# EasyEDA Pro project ProPrj_arduinouno_2024-09-28.epro

# Schematic Schematic1
Board Name: Board1; Create Date: 2024-09-04
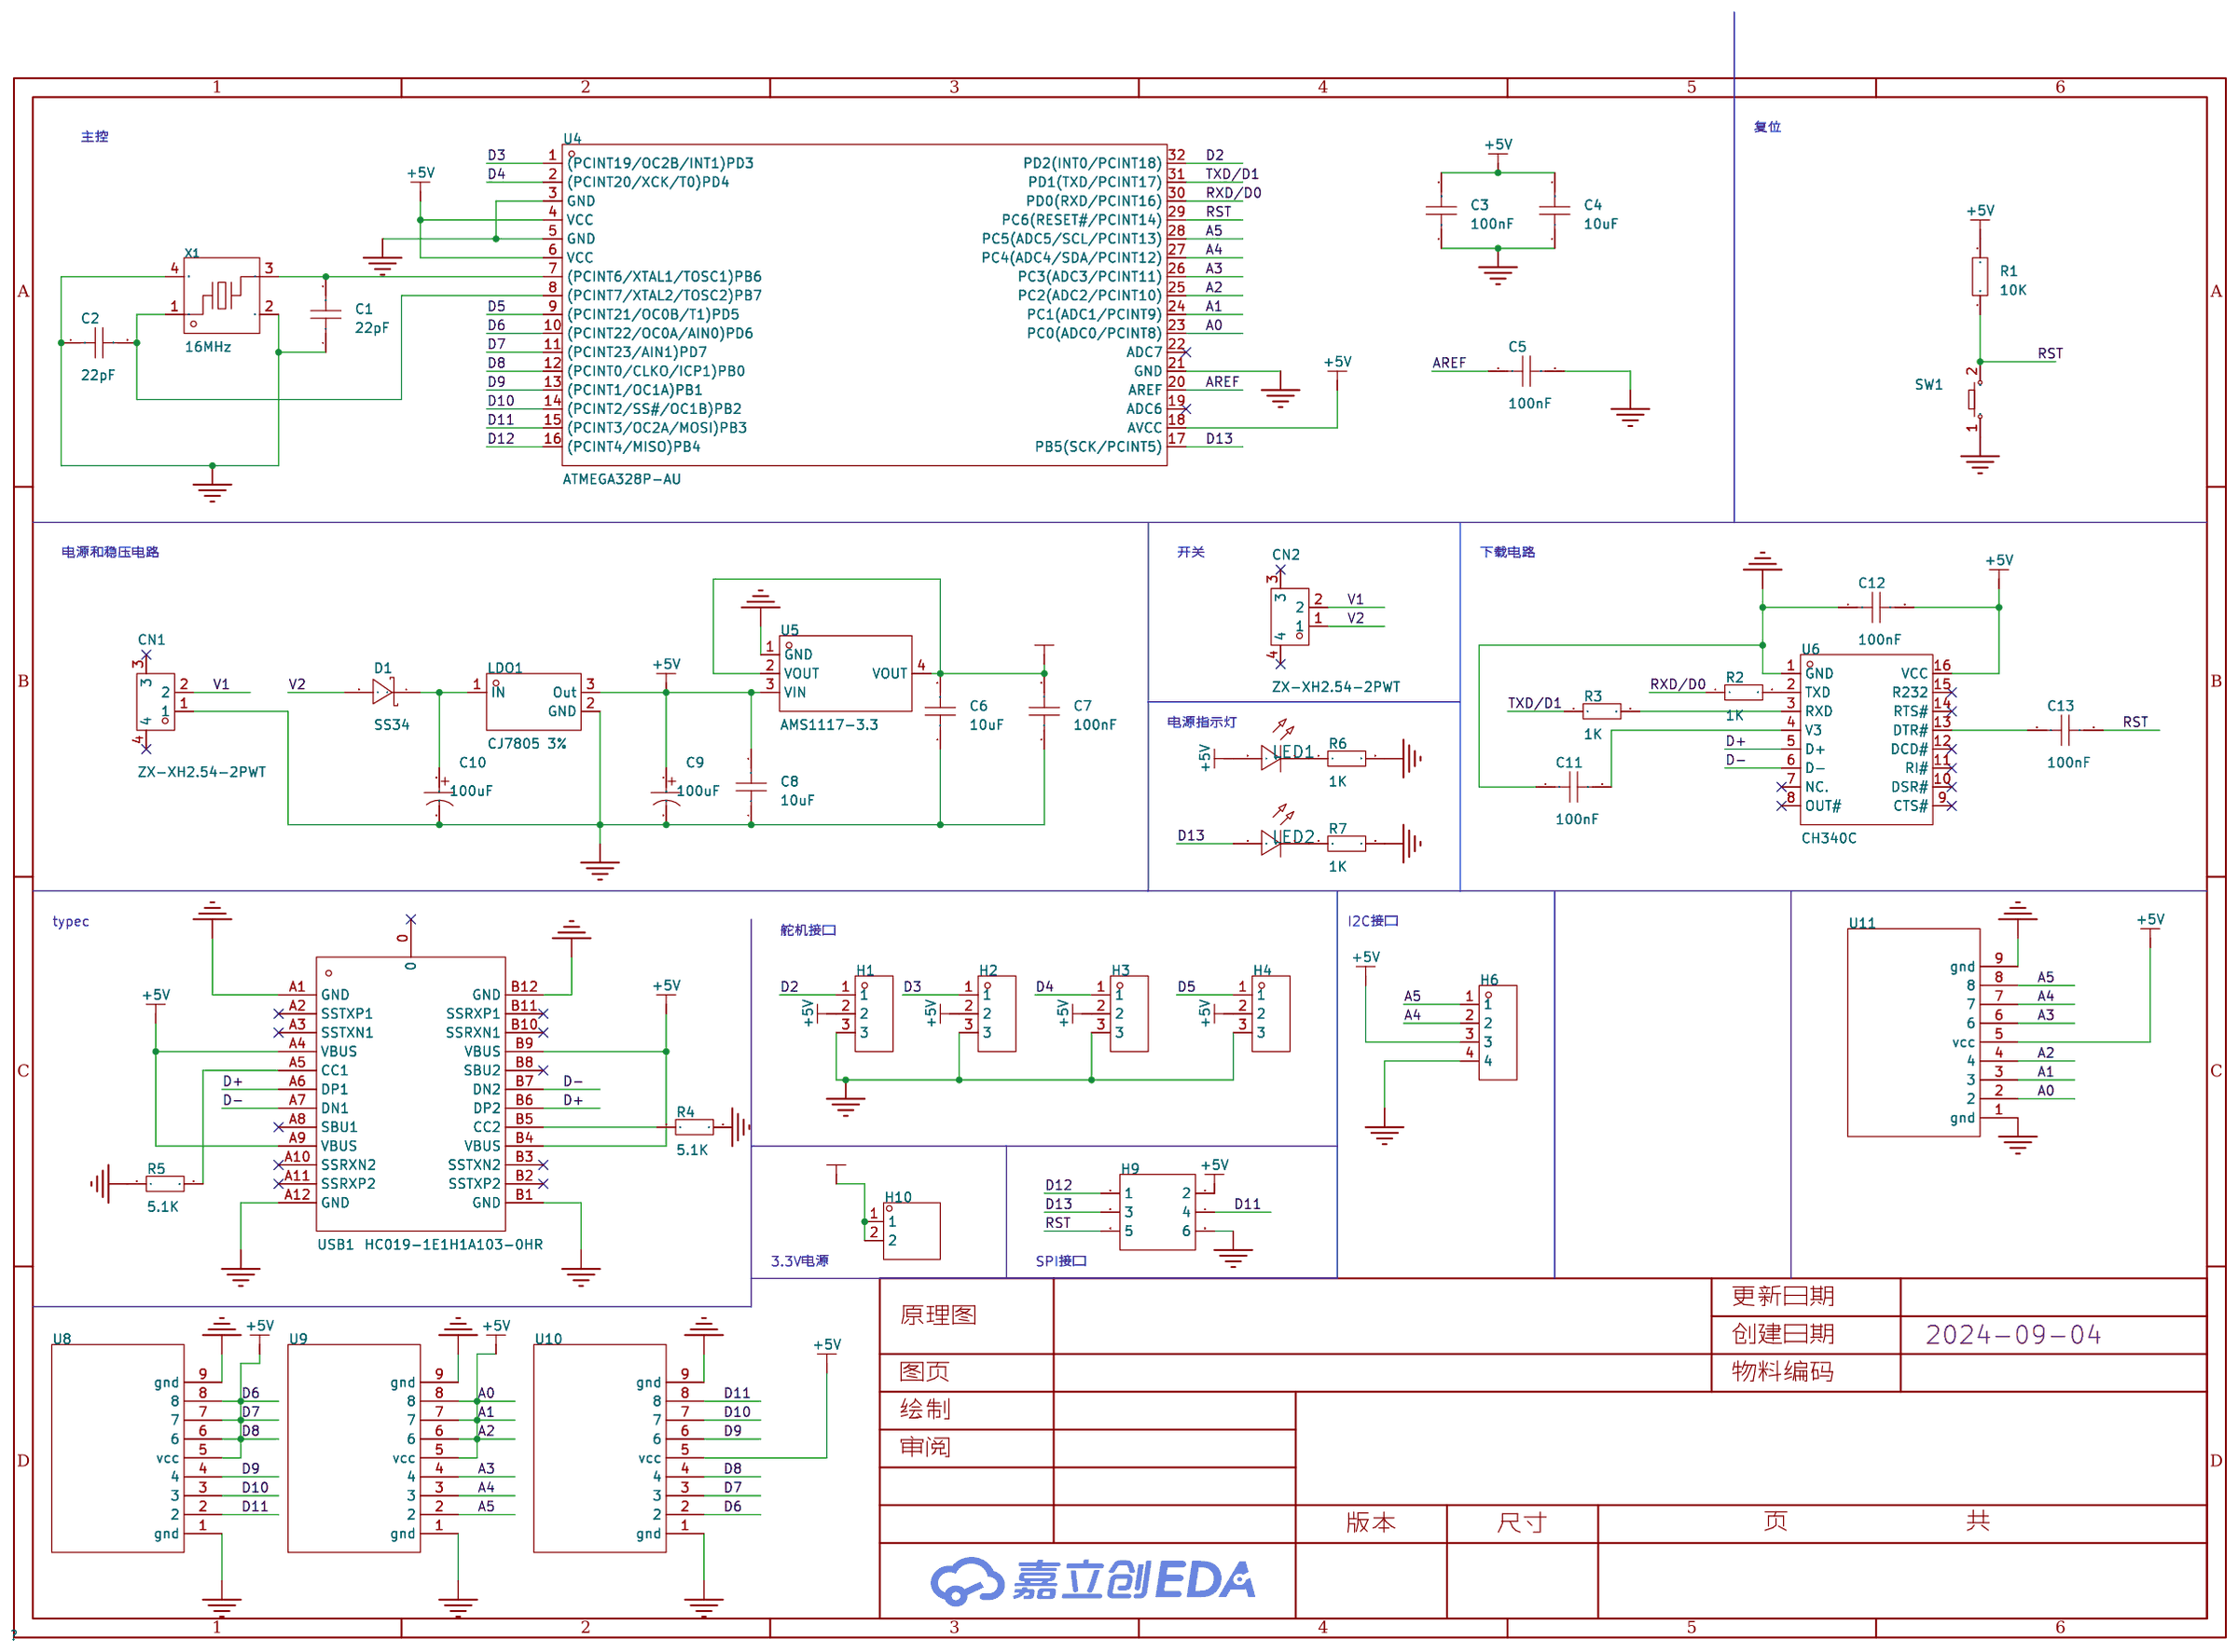
[diagram p0: schematic sheet]

## Parts
C1  22pF  [C0603]
C2  22pF  [C0603]
C3  100nF  [C0603]
C4  10uF  [C0603]
C5  100nF  [C0603]
C6  10uF  [C0603]
C7  100nF  [C0603]
C8  10uF  [C0603]
C9  100uF  [CAP-SMD_BD6.3-L6.6-W6.6-LS7.2-R-RD]
C10  100uF  [CAP-SMD_BD6.3-L6.6-W6.6-LS7.2-R-RD]
C11  100nF  [C0603]
C12  100nF  [C0603]
C13  100nF  [C0603]
CN1  ZX-XH2.54-2PWT  [CONN-SMD_2P-P2.54_MEGASTAR_ZX-XH2.54-2PWT]
CN2  ZX-XH2.54-2PWT  [CONN-SMD_2P-P2.54_MEGASTAR_ZX-XH2.54-2PWT]
D1  SS34  [SMA_L4.4-W2.8-LS5.4-RD]
H1  -  [HDR-TH_3P-P2.54-V-M]
H2  -  [HDR-TH_3P-P2.54-V-M]
H3  -  [HDR-TH_3P-P2.54-V-M]
H4  -  [HDR-TH_3P-P2.54-V-M]
H6  -  [HDR-TH_4P-P2.54-V-M]
H9  -  [HDR-TH_6P-P2.54-V-R2-C3-S2.54_A2541WV-2X3P]
H10  -  [HDR-TH_2P-P2.54-V-M-1]
LDO1  CJ7805 3%  [TO-252-2_L6.6-W6.1-P4.58-LS10.1-BR-CW]
LED1  -  [LED_0603]
LED2  -  [LED_0603]
R1  10K  [R0603]
R2  1K  [R0603]
R3  1K  [R0603]
R4  5.1K  [R0603]
R5  5.1K  [R0603]
R6  1K  [R0603]
R7  1K  [R0603]
SW1  -  [Key_SMD_3x4x2]
U4  ATMEGA328P-AU  [TQFP-32_L7.0-W7.0-P0.80-LS9.0-BL]
U5  AMS1117-3.3  [SOT-223-3_L6.5-W3.4-P2.30-LS7.0-BR]
U6  CH340C  [SOP-16_L10.0-W3.9-P1.27-LS6.0-BL]
U8  -  [金手指（20p)]
U9  -  [金手指（20p)]
U10  -  [金手指（20p)]
U11  -  [金手指（20p)]
USB1  HC019-1E1H1A103-0HR  [USB-C-SMD_HC019-1E1H1A103-0HR]
X1  16MHz  [CRYSTAL-SMD_4P-L3.2-W2.5-BL-2]

## Library data of the parts
C1-C8 C11-C13 = CAP_0603: Supplier Footprint: 0603
C9 C10 = RVE1V101M0607_C99837: 容值:100uF;精度:±20%;额定电压:35V;纹波电流:230mA@120Hz;等效串联电阻:600mΩ;; LCSC Part Name: 100uF ±20% 35V; Supplier Part: C99837; Manufacturer: ROQANG(容强); Manufacturer Part: RVE1V101M0607; Supplier Footprint: SMD,D6.3xL7.7mm; Datasheet: https://atta.szlcsc.com/upload/public/pdf/source/20170408/1491621582616.pdf; Supplier: LCSC; Tolerance: ±20%; Rated Voltage: 35V; Ripple Current: 230mA@120Hz; Equivalent Series Resistance(ESR): 600mΩ; φD: 6.3mm; L: 7.7mm; Lifetime @ Temp: 2000hrs@105℃; Operating Temperature: -55℃~+105℃
CN1 CN2 = ZX-XH2.54-2PWT: 插针结构:1x2P;间距:2.54mm;安装方式:卧贴;参考系列:XH;总PIN数:2P;排数:1;每排PIN数:2;行距:-;额定电流:3A;触头材质:黄铜;触头镀层:锡;工作温度范围:-25℃~+85℃;; Supplier Part: C7429671; Manufacturer: Megastar(兆星); Supplier Footprint: SMD,P=2.54mm,卧贴; JLCPCB Part Class: 扩展库; Datasheet: https://atta.szlcsc.com/upload/public/pdf/source/20230619/D2020A0565D707024C90AEAD14B7AF42.pdf; Supplier: LCSC; Pins Structure: 1x2P; Pitch: 2.54mm; Mounting Style: 卧贴; Reference Series: XH; Number of Pins: 2P; Number of Rows: 1; Number of PINs Per Row: 2; Current Rating (Max): 3A; Contact Material: 黄铜; Contact Plating: 锡; Operating Temperature Range: -25℃~+85℃
D1 = SS34_C266553: 正向压降(Vf):500mV@3A;直流反向耐压(Vr):40V;整流电流:3A;; LCSC Part Name: 电压:40V 电流:3A; Supplier Part: C266553; Manufacturer: BORN(伯恩半导体); Supplier Footprint: SMA(DO-214AC); JLCPCB Part Class: 扩展库; Datasheet: https://atta.szlcsc.com/upload/public/pdf/source/20180817/C266554_F1CD22E2170B80947B6B70E19B5A0CE6.pdf; Supplier: LCSC; Forward Voltage (Vf@If): 500mV@3A; Reverse Voltage (Vr): 40V; Rectified Current: 3A
H1-H4 = HDR-M_2.54_1x3P: Supplier Part: C2937625; Supplier Footprint: 插件
H6 = HDR-M_2.54_1x4P: Supplier Part: C492403; Supplier Footprint: 插件
H9 = HDR-M_2.54_2x3: Supplier Part: C402781; Supplier Footprint: 插件,P=2.54mm
H10 = HDR-M_2.54_1x2P: Supplier Part: C124375; Supplier Footprint: 插件
LDO1 = CJ7805 3%: 输出类型:固定;最大输入电压:35V;输出电压:5V;最大输出电流:1.5A;输出极性:正极;; LCSC Part Name: 输入35V 输出5V 1.5A; Supplier Part: C21706; Manufacturer: CJ(江苏长电/长晶); Supplier Footprint: TO-252-2(DPAK); JLCPCB Part Class: 扩展库; Datasheet: https://atta.szlcsc.com/upload/public/pdf/source/20171228/C164904_15144413121361213907.pdf; Supplier: LCSC; Output Type: 固定; Maximum Input Voltage: 35V; Output Voltage: 5V; MAX Output Current: 1.5A; Dropout Voltage: 2V@(1A); Output Polarity: 正极; Number of Outputs: 1
LED1 LED2 = LED_0603-R: Supplier Footprint: 0603
R1-R7 = Res_0603: Supplier Footprint: 0603
SW1 = Key_SMD_3x4x2: Supplier Footprint: SMD
U4 = ATMEGA328P-AU: CPU内核:AVR;程序存储容量:32KB;RAM总容量:2KB;GPIO端口数量:23;工作电压范围:1.8V~5.5V;CPU最大主频:20MHz;程序存储器类型:FLASH;应用领域:-;; LCSC Part Name: 基于AVR增强型RISC架构的低功耗CMOS 8位微控制器; Supplier Part: C14877; Manufacturer: MICROCHIP(美国微芯); Supplier Footprint: TQFP-32(7x7); Datasheet: https://atta.szlcsc.com/upload/public/pdf/source/20140621/1457707095197.pdf; Supplier: LCSC; CPU Core: AVR; Program Storage Size: 32KB; RAM Size: 2KB; GPIO Ports Number: 23; Operating Voltage Range: 1.8V~5.5V; CPU Maximum Speed: 20MHz; Program Memory Type: FLASH; EEPROM: 1KB; Operating Temperature Range: -40℃~+85℃; ADC (Bit): 10bit; Peripheral/Function: 看门狗；PWM；看门狗；PWM; Watchdog: 有; Low-Voltage Detect: 有; Internal Oscillator: 有
U5 = AMS1117-3.3_C6186: 输出类型:固定;最大输入电压:-;输出电压:3.3V;最大输出电流:1A;电源纹波抑制比(PSRR):72dB@(120Hz);输出极性:正极;; LCSC Part Name: 输出3.3V 1A; Supplier Part: C6186; Manufacturer: AMS; Supplier Footprint: SOT-223; Datasheet: https://atta.szlcsc.com/upload/public/pdf/source/20180727/C6186_7A095716F0823C02F1997A905E26C086.pdf; Supplier: LCSC; Output Type: 固定; Output Voltage: 3.3V; MAX Output Current: 1A; Power Supply Rejection Ratio (PSRR): 72dB@(120Hz); Dropout Voltage: 1.3V@(800mA); Output Polarity: 正极; Number of Outputs: 1
U6 = CH340C: 应用功能:收发器;接口协议:USB 2.0;数据速率:2Mbps;; LCSC Part Name: CH340C USB转串口芯片 CH340; Supplier Part: C84681; Manufacturer: WCH(南京沁恒); Supplier Footprint: SOP-16; JLCPCB Part Class: 扩展库; Datasheet: https://atta.szlcsc.com/upload/public/pdf/source/20200819/C84681_ADBED554CE321879DBD6B1D06488689C.pdf; Supplier: LCSC; Applications Function: 收发器; Protocol: USB 2.0; Supply Voltage: 3.3V；5V; Data Rate: 2Mbps
U8-U11 = 2.54金手指（20p)
USB1 = HC019-1E1H1A103-0HR: 连接器类型:Type-C;标准:-;公母:母;端口数量:1;触点数量:24P;安装方式:立贴;额定电流 - 电源:5A;触头材质:高导铜;触头镀层:金;工作温度范围:-25℃~+85℃;焊接温度(最大值):260℃;; LCSC Part Name: Type-C 母 立贴; Supplier Part: C2894918; Manufacturer: HCTL(华灿天禄); Supplier Footprint: SMD; JLCPCB Part Class: 扩展库; Datasheet: https://atta.szlcsc.com/upload/public/pdf/source/20221116/A833A3B5655DC5CBECD3BDA709D92211.pdf; Supplier: LCSC; Connector Type: Type-C; Gender: 母; Number of Ports: 1; Number of Contacts: 24P; Mounting Style: 立贴; Current Rating - Power (Max): 5A; Contact Material: 高导铜; Contact Plating: 金; Operating Temperature Range: -25℃~+85℃; Soldering Temperature(Max): 260℃
X1 = NX3225SA-16MHz-STD-CSR-6: 频率:16MHz;常温频差:±15ppm;外接负载电容:8pF;频率稳定度(全温):±25ppm;; LCSC Part Name: 16MHz ±15ppm 8pF; Supplier Part: C880097; Manufacturer: NDK; Supplier Footprint: SMD3225-4P; JLCPCB Part Class: 扩展库; Supplier: LCSC; Normal temperature Frequency Tolerance: ±15ppm; External load capacitor: 8pF; Frequency Stability(Full temperature range): ±25ppm; Equivalent Series Resistance (ESR): 80Ω; Operating Temperature: -40℃~+85℃

## Nets
3V3: C6.2 C7.2 H10.1 H10.2 U5.2(VOUT) U5.4(VOUT)
+5V: C3.2 C4.2 C8.2 C9.1 C12.2 H1.2 H2.2 H3.2 H4.2 H6.3 H9.2 LDO1.3(Out) LED1.2(A) R1.2 U4.4(VCC) U4.6(VCC) U4.18(AVCC) U5.3(VIN) U6.16(VCC) U8.5(vcc) U9.5(vcc) U10.5(vcc) U11.5(vcc) USB1.A4(VBUS) USB1.A9(VBUS) USB1.B4(VBUS) USB1.B9(VBUS)
GND: C1.1 C2.1 C3.1 C4.1 C5.2 C6.1 C7.1 C8.1 C9.2 C10.2 C11.1 C12.1 CN1.1 H1.3 H2.3 H3.3 H4.3 H6.4 H9.6 LDO1.2(GND) R4.2 R5.1 R6.2 R7.2 SW1.1 U4.3(GND) U4.5(GND) U4.21(GND) U5.1(GND) U6.1(GND) U8.1(gnd) U8.9(gnd) U9.1(gnd) U9.9(gnd) U10.1(gnd) U10.9(gnd) U11.1(gnd) U11.9(gnd) USB1.A1(GND) USB1.A12(GND) USB1.B1(GND) USB1.B12(GND) X1.2(GND) X1.4(GND)
V1: CN1.2 CN2.2
V2: CN2.1 D1.2(A)
A0: U4.23(PC0(ADC0/PCINT8)) U9.8 U11.2
A1: U4.24(PC1(ADC1/PCINT9)) U9.7 U11.3
A2: U4.25(PC2(ADC2/PCINT10)) U9.6 U11.4
A3: U4.26(PC3(ADC3/PCINT11)) U9.4 U11.6
A4: H6.2 U4.27(PC4(ADC4/SDA/PCINT12)) U9.3 U11.7
A5: H6.1 U4.28(PC5(ADC5/SCL/PCINT13)) U9.2 U11.8
AREF: C5.1 U4.20(AREF)
D2: H1.1 U4.32(PD2(INT0/PCINT18))
D3: H2.1 U4.1((PCINT19/OC2B/INT1)PD3)
D4: H3.1 U4.2((PCINT20/XCK/T0)PD4)
D5: H4.1 U4.9((PCINT21/OC0B/T1)PD5)
D6: U4.10((PCINT22/OC0A/AIN0)PD6) U8.8 U10.2
D7: U4.11((PCINT23/AIN1)PD7) U8.7 U10.3
D8: U4.12((PCINT0/CLKO/ICP1)PB0) U8.6 U10.4
D9: U4.13((PCINT1/OC1A)PB1) U8.4 U10.6
D10: U4.14((PCINT2/SS#/OC1B)PB2) U8.3 U10.7
D11: H9.4 U4.15((PCINT3/OC2A/MOSI)PB3) U8.2 U10.8
D12: H9.1 U4.16((PCINT4/MISO)PB4)
D13: H9.3 LED2.2(A) U4.17(PB5(SCK/PCINT5))
D+: U6.5(D+) USB1.A6(DP1) USB1.B6(DP2)
D-: U6.6(D-) USB1.A7(DN1) USB1.B7(DN2)
RST: C13.2 H9.5 R1.1 SW1.2 U4.29(PC6(RESET#/PCINT14))
RXD/D0: R2.1 U4.30(PD0(RXD/PCINT16))
TXD/D1: R3.1 U4.31(PD1(TXD/PCINT17))
$1N1524: C1.2 U4.7((PCINT6/XTAL1/TOSC1)PB6) X1.3
$1N1530: C2.2 U4.8((PCINT7/XTAL2/TOSC2)PB7) X1.1
$1N2494: C10.1 D1.1(C) LDO1.1(IN)
$1N3868: R2.2 U6.2(TXD)
$1N3894: R3.2 U6.3(RXD)
$1N4022: C11.2 U6.4(V3)
$1N11196: LED1.1(C) R6.1
$1N13420: R4.1 USB1.B5(CC2)
$1N13426: R5.2 USB1.A5(CC1)
$1N15243: C13.1 U6.13(DTR#)
Net-(LED2-1): LED2.1(C) R7.1

Not connected (* = marked no-connect by the designer): CN1 3* 4*; CN2 3* 4*; U4 19(ADC6)* 22(ADC7)*; U6 7(NC.)* 8(OUT#)* 9(CTS#)* 10(DSR#)* 11(RI#)* 12(DCD#)* 14(RTS#)* 15(R232)*; USB1 0* A2(SSTXP1)* A3(SSTXN1)* A8(SBU1)* A10(SSRXN2)* A11(SSRXP2)* B2(SSTXP2)* B3(SSTXN2)* B8(SBU2)* B10(SSRXN1)* B11(SSRXP1)*

## Notes on the sheet
- 主控
- 复位
- 电源和稳压电路
- 开关
- 下载电路
- 电源指示灯
- typec
- 舵机接口
- I2C接口
- 3.3V电源
- SPI接口

# Board PCB1
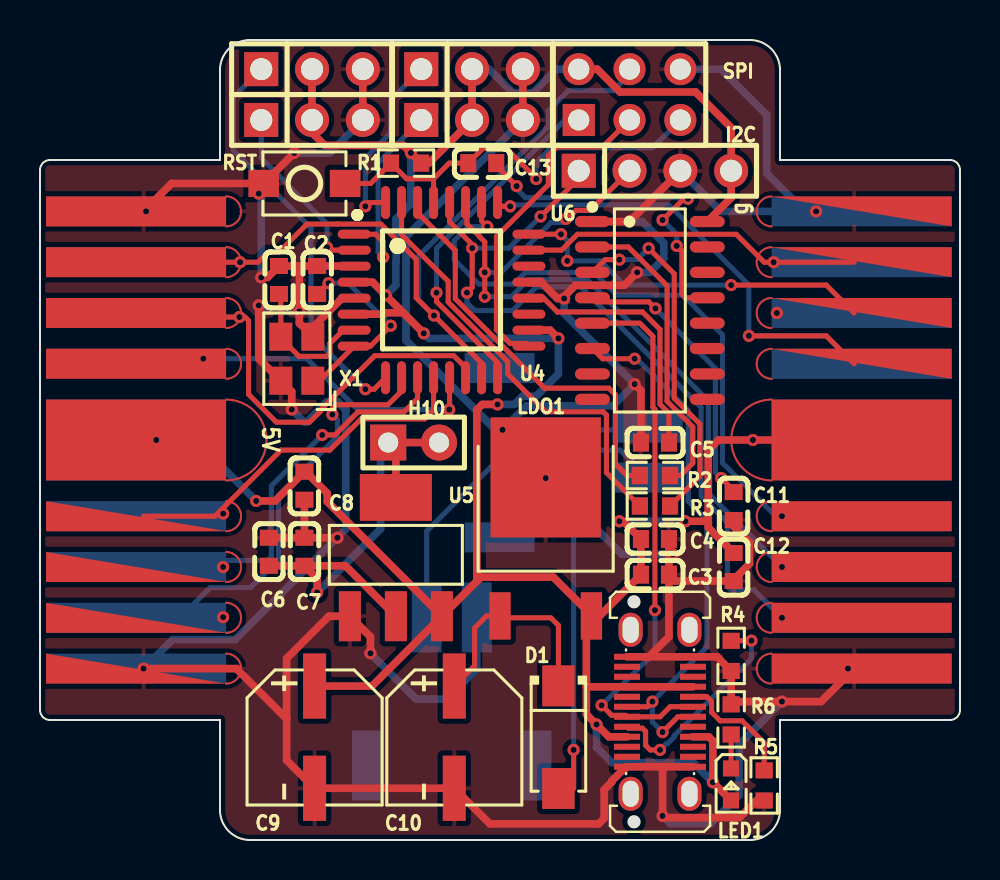
[diagram p1: board, top side]
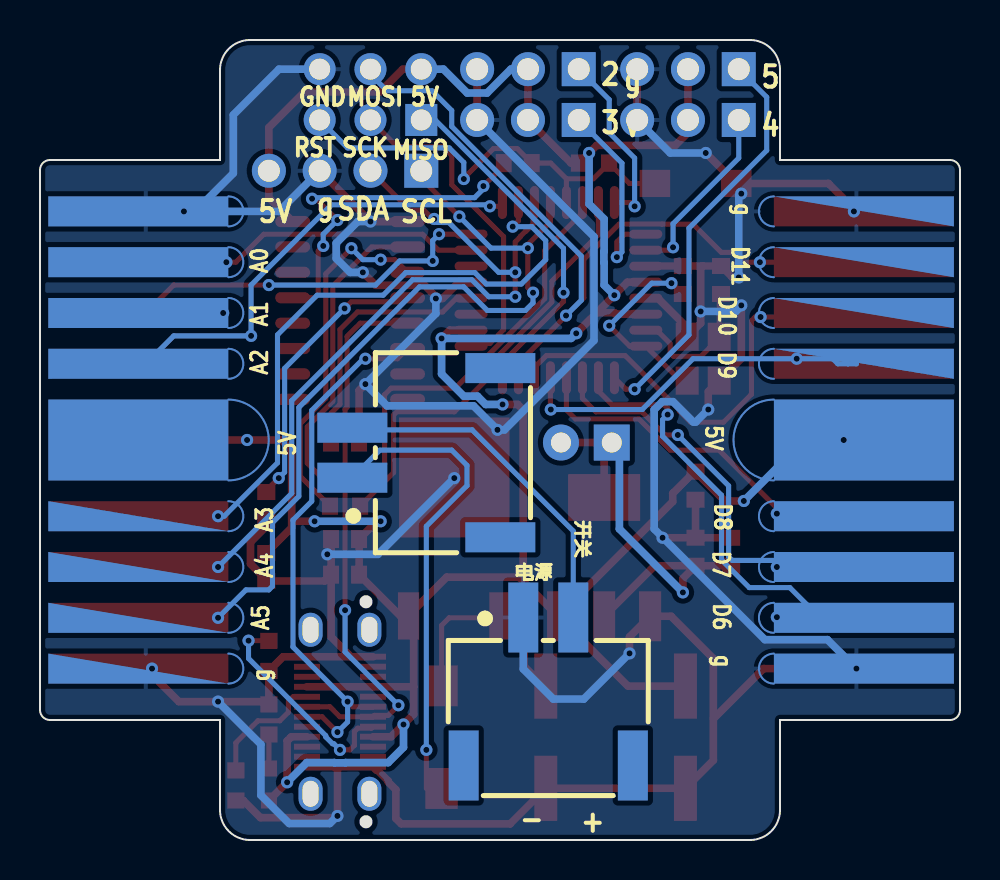
[diagram p2: board, bottom side, seen from below]

Outline 46 x 40 mm; copper layers: Top Layer, Bottom Layer. Coordinates in mm from the lower left corner of the outline.
Outline path: 0,33.5 arc(0.15,33.85) 0.5,34 9,34 9,38.5 arc(9.44,39.56) 10.5,40 35.5,40 arc(36.56,39.56) 37,38.5 37,34 45.5,34 arc(45.85,33.85) 46,33.5 46,6.5 arc(45.85,6.15) 45.5,6 37,6 37,1.5 arc(36.56,0.44) 35.5,0 10.5,0 arc(9.44,0.44) 9,1.5 9,6 0.5,6 arc(0.15,6.15) 0,6.5 0,33.5
Stack: Top Layer 0.035mm / Dielectric1 1.51mm FR4 er 4.5 / Bottom Layer 0.035mm

## Design rules (mm)
template: 自定义配置
spacing copperThickness1oz (default): track to track 0.102, other pairs 0.152 to 0.3
spacing copperThickness2oz: track to track 0.203, other pairs 0.152 to 0.3
track width copperThickness1oz (default): min 0.127, default 0.254, max 2.54
track width copperThickness2oz: min 0.203, default 0.254, max 2.54
track width 电源: min 0.127, default 0.381, max 2.54
differential pair differentialPair (default): width min 0.127, default 0.254, max 2.54; gap min 0.152, default 0.152
via viaSize (default): diameter min 0.5, default 0.61, max 10; hole min 0.3, default 0.305, max 6.299
net GND uses 电源
net +5V uses 电源
net 3V3 uses 电源

## Placement (name value [footprint] x y rotation side)
C1  22pF  [C0603]  11.95 28 270 top
C2  22pF  [C0603]  13.86 28 270 top
C3  100nF  [C0603]  30.75 15.05 180 top
C4  10uF  [C0603]  30.75 13.27 180 top
C5  100nF  [C0603]  30.75 19.87 180 top
C6  10uF  [C0603]  11.44 14.41 270 top
C7  100nF  [C0603]  13.22 14.41 270 top
C8  10uF  [C0603]  13.22 17.71 90 top
C9  100uF  [CAP-SMD_BD6.3-L6.6-W6.6-LS7.2-R-RD]  13.73 5.14 90 top
C10  100uF  [CAP-SMD_BD6.3-L6.6-W6.6-LS7.2-R-RD]  20.71 5.14 90 top
C11  100nF  [C0603]  34.68 16.7 90 top
C12  100nF  [C0603]  34.68 13.65 90 top
C13  100nF  [C0603]  22.11 33.84 180 top
D1  SS34  [SMA_L4.4-W2.8-LS5.4-RD]  25.92 5.14 270 top
H1  -  [HDR-TH_3P-P2.54-V-M]  21.6 38.54 0 top
H2  -  [HDR-TH_3P-P2.54-V-M]  21.6 36 0 top
H3  -  [HDR-TH_3P-P2.54-V-M]  13.6 36 0 top
H4  -  [HDR-TH_3P-P2.54-V-M]  13.6 38.54 0 top
H10  -  [HDR-TH_2P-P2.54-V-M-1]  18.68 19.87 0 top
I2C  -  [HDR-TH_4P-P2.54-V-M]  30.75 33.46 0 top
LDO1  CJ7805 3%  [TO-252-2_L6.6-W6.1-P4.58-LS10.1-BR-CW]  25.29 14.67 270 top
LED1  -  [LED_0603]  34.56 2.73 270 top
R1  10K  [R0603]  18.3 33.84 0 top
R2  1K  [R0603]  30.75 18.22 0 top
R3  1K  [R0603]  30.75 16.7 0 top
R4  5.1K  [R0603]  34.56 9.2 270 top
R5  5.1K  [R0603]  36.21 2.73 90 top
R6  1K  [R0603]  34.56 6.03 90 top
RST  -  [Key_SMD_3x4x2]  13.22 32.83 0 top
SPI  -  [HDR-TH_6P-P2.54-V-R2-C3-S2.54_A2541WV-2X3P]  29.48 37.27 0 top
U4  ATMEGA328P-AU  [TQFP-32_L7.0-W7.0-P0.80-LS9.0-BL]  20.08 27.49 270 top
U5  AMS1117-3.3  [SOT-223-3_L6.5-W3.4-P2.30-LS7.0-BR]  17.79 14.16 270 top
U6  CH340C  [SOP-16_L10.0-W3.9-P1.27-LS6.0-BL]  30.49 26.48 270 top
U8  -  [金手指（20p)]  0.3 20 270 top
U9  -  [金手指（20p)]  45.58 20 90 top
U10  -  [金手指（20p)]  0.3 20 90 bottom
U11  -  [金手指（20p)]  45.58 20 270 bottom
USB1  HC019-1E1H1A103-0HR  [USB-C-SMD_HC019-1E1H1A103-0HR]  31 6.41 90 top
X1  16MHz  [CRYSTAL-SMD_4P-L3.2-W2.5-BL-2]  12.84 24.06 90 top
开关  ZX-XH2.54-2PWT  [CONN-SMD_2P-P2.54_MEGASTAR_ZX-XH2.54-2PWT]  26.68 19.36 90 bottom
电源  ZX-XH2.54-2PWT  [CONN-SMD_2P-P2.54_MEGASTAR_ZX-XH2.54-2PWT]  20.59 7.43 180 bottom

## Footprints (pads in the part's own frame, mm; a bottom-side part is the same pattern mirrored in y, then rotated)
C0603
  rect 0.8x0.9 smd: 1(-0.7,0) 2(0.7,0)
CAP-SMD_BD6.3-L6.6-W6.6-LS7.2-R-RD
  rect 3.26x1.15 smd: 1(2.555,0) 2(-2.555,0)
CONN-SMD_2P-P2.54_MEGASTAR_ZX-XH2.54-2PWT
  rect 1.5x3.5 smd: 1(-1.25,3.7) 2(1.25,3.7) 3(-4.23,-3.7) 4(4.23,-3.7)
CRYSTAL-SMD_4P-L3.2-W2.5-BL-2
  rect 1.4x1.15 smd: 1(-1.1,-0.8) 2(1.1,-0.8) 3(1.1,0.8) 4(-1.1,0.8)
HDR-TH_2P-P2.54-V-M-1
  rect 1.8x1.8 hole 1: 1(-1.27,0)
  round 1.8 hole 1: 2(1.27,0)
HDR-TH_3P-P2.54-V-M
  rect 1.7x1.7 hole 1.1: 1(-2.54,0)
  round 1.7 hole 1.1: 2(0,0) 3(2.54,0)
HDR-TH_4P-P2.54-V-M
  rect 1.7x1.7 hole 1.1: 1(-3.81,0)
  round 1.7 hole 1.1: 2(-1.27,0) 3(1.27,0) 4(3.81,0)
HDR-TH_6P-P2.54-V-R2-C3-S2.54_A2541WV-2X3P
  rect 1.6x1.6 hole 1.05: 1(-2.54,-1.27)
  round 1.6 hole 1.05: 2(-2.54,1.27) 3(0,-1.27) 4(0,1.27) 5(2.54,-1.27) 6(2.54,1.27)
Key_SMD_3x4x2
  rect 1.53x1.36 smd: 1(-2.035,0) 2(2.035,0)
LED_0603
  rect 0.8x0.8 smd: 1(-0.851,-0.01) 2(0.75,-0.005)
R0603
  rect 0.806x0.864 smd: 1(-0.753,0) 2(0.753,0)
SMA_L4.4-W2.8-LS5.4-RD
  rect 2.046x1.62 smd: 1(-2.566,0) 2(2.566,0)
SOP-16_L10.0-W3.9-P1.27-LS6.0-BL
  oval 0.56x1.745 smd: 1(-4.445,-2.873) 2(-3.175,-2.873) 3(-1.905,-2.873) 4(-0.635,-2.873) 5(0.635,-2.873) 6(1.905,-2.873) 7(3.175,-2.873) 8(4.445,-2.873) 9(4.445,2.873) 10(3.175,2.873) 11(1.905,2.873) 12(0.635,2.873) 13(-0.635,2.873) 14(-1.905,2.873) 15(-3.175,2.873) 16(-4.445,2.873)
SOT-223-3_L6.5-W3.4-P2.30-LS7.0-BR
  rect 2.5x1.1 smd: 1(2.97,-2.3) 2(2.97,0) 3(2.97,2.3)
  rect 2.34x3.6 smd: 4(-2.97,0)
TO-252-2_L6.6-W6.1-P4.58-LS10.1-BR-CW
  rect 2.364x1.064 smd: 1(3.462,-2.286) 3(3.462,2.286)
  rect 6.004x5.512 smd: 2(-3.462,0)
TQFP-32_L7.0-W7.0-P0.80-LS9.0-BL
  oval 0.45x1.65 smd: 1(-2.8,-4.369) 2(-2,-4.369) 3(-1.2,-4.369) 4(-0.4,-4.369) 5(0.4,-4.369) 6(1.2,-4.369) 7(2,-4.369) 8(2.8,-4.369) 17(2.8,4.369) 18(2,4.369) 19(1.2,4.369) 20(0.4,4.369) 21(-0.4,4.369) 22(-1.2,4.369) 23(-2,4.369) 24(-2.8,4.369)
  oval 1.65x0.45 smd: 9(4.381,-2.8) 10(4.381,-2) 11(4.381,-1.2) 12(4.381,-0.4) 13(4.381,0.4) 14(4.381,1.2) 15(4.381,2) 16(4.381,2.8) 25(-4.381,2.8) 26(-4.381,2) 27(-4.381,1.2) 28(-4.381,0.4) 29(-4.381,-0.4) 30(-4.381,-1.2) 31(-4.381,-2) 32(-4.381,-2.8)
USB-C-SMD_HC019-1E1H1A103-0HR
  oval 1.7x1.2 hole 1.3x0.8: 0(-4.1,1.47) 0(-4.1,-1.47) 0(4.1,1.47) 0(4.1,-1.47)
  rect 0.3x1.3 smd: A1(2.75,-1.65) A2(2.25,-1.65) A3(1.75,-1.65) A4(1.25,-1.65) A5(0.75,-1.65) A6(0.25,-1.65) A7(-0.25,-1.65) A8(-0.75,-1.65) A9(-1.25,-1.65) A10(-1.75,-1.65) A11(-2.25,-1.65) A12(-2.75,-1.65) B1(-2.75,1.65) B2(-2.25,1.65) B3(-1.75,1.65) B4(-1.25,1.65) B5(-0.75,1.65) B6(-0.25,1.65) B7(0.25,1.65) B8(0.75,1.65) B9(1.25,1.65) B10(1.75,1.65) B11(2.25,1.65) B12(2.75,1.65)
金手指（20p)
  custom 1.5x9.75 smd: 1(-11.43,4.875) 2(-8.89,4.875) 3(-6.35,4.875) 4(-3.81,4.875) 6(3.81,4.875) 7(6.35,4.875) 8(8.89,4.875) 9(11.43,4.875)
  custom 4.04x11.02 smd: 5(0,5.51)

## Nets
3V3: C6.2 C7.2 H10.1 H10.2 U5.2 U5.4
+5V: C3.2 C4.2 C8.2 C9.1 C12.2 H1.2 H2.2 H3.2 H4.2 I2C.4 LDO1.3 LED1.2 R1.2 SPI.2 U4.4 U4.6 U4.18 U5.3 U6.16 U8.5 U9.5 U10.5 U11.5 USB1.A4 USB1.A9 USB1.B4 USB1.B9
GND: C1.1 C2.1 C3.1 C4.1 C5.2 C6.1 C7.1 C8.1 C9.2 C10.2 C11.1 C12.1 H1.3 H2.3 H3.3 H4.3 I2C.3 LDO1.2 R4.2 R5.1 R6.2 RST.1 SPI.6 U4.3 U4.5 U4.21 U5.1 U6.1 U8.1 U8.9 U9.1 U9.9 U10.1 U10.9 U11.1 U11.9 USB1.A1 USB1.A12 USB1.B1 USB1.B12 X1.2 X1.4 电源.1
V1: 开关.2 电源.2
V2: D1.2 开关.1
A0: U4.23 U9.8 U11.2
A1: U4.24 U9.7 U11.3
A2: U4.25 U9.6 U11.4
A3: U4.26 U9.4 U11.6
A4: I2C.2 U4.27 U9.3 U11.7
A5: I2C.1 U4.28 U9.2 U11.8
AREF: C5.1 U4.20
D2: H1.1 U4.32
D3: H2.1 U4.1
D4: H3.1 U4.2
D5: H4.1 U4.9
D6: U4.10 U8.8 U10.2
D7: U4.11 U8.7 U10.3
D8: U4.12 U8.6 U10.4
D9: U4.13 U8.4 U10.6
D10: U4.14 U8.3 U10.7
D11: SPI.4 U4.15 U8.2 U10.8
D12: SPI.1 U4.16
D13: SPI.3 U4.17
D+: U6.5 USB1.A6 USB1.B6
D-: U6.6 USB1.A7 USB1.B7
RST: C13.2 R1.1 RST.2 SPI.5 U4.29
RXD/D0: R2.1 U4.30
TXD/D1: R3.1 U4.31
$1N1524: C1.2 U4.7 X1.3
$1N1530: C2.2 U4.8 X1.1
$1N2494: C10.1 D1.1 LDO1.1
$1N3868: R2.2 U6.2
$1N3894: R3.2 U6.3
$1N4022: C11.2 U6.4
$1N11196: LED1.1 R6.1
$1N13420: R4.1 USB1.B5
$1N13426: R5.2 USB1.A5
$1N15243: C13.1 U6.13

Pads without a net: U4 19 22; U6 7 8 9 10 11 12 14 15; USB1 0 A2 A3 A8 A10 A11 B2 B3 B8 B10 B11; 开关 3 4; 电源 3 4

## Via types
v1: diameter 0.61, hole 0.305, Top Layer to Bottom Layer, 85 vias

## Routing (per net, layer and track width the routed paths; a pad name or vN(x,y) marks a point on that pad's centre or on a via; arc(x,y) is an arc through that point)
3V3: length 23.8
  Top Layer w0.381: v1(13.86,12.38) 13.86,13.08 C7.2 ; 20.33,20.13 20.08,19.87 17.79,19.87 U5.4 ; C7.2 C6.2 ; C7.2 15.27,13.71 U5.2
  Bottom Layer w0.381: 17.79,20.13 17.03,19.36 17.03,15.56 v1(13.86,12.38)
+5V: length 158.7
  Top Layer w0.381: v1(22.87,21.78) 22.11,21.78 21.84,21.51 21.84,12.94 ; USB1.A9 33.44,5.16 33.64,4.95 v1(33.64,2.89) LED1.2 ; 20.09,11.19 16.6,7.7 C9.1 ; 20.09,11.19 14.36,16.92 14.36,17.33 13.28,18.41 C8.2 11.76,16.95 v1(10.81,16.95) ; 20.09,11.19 21.84,12.94 ; U4.6 17.2,26.29 17.27,26.36 18.16,26.36 ; 18.16,26.36 v1(19.19,25.33) ; 18.16,26.36 v1(17.28,27.24) 16.63,27.89 U4.4 ; 33.41,15.89 33.36,15.94 v1(32.27,15.94) ; 33.41,15.89 33.41,19.49 33.92,20 v1(35.65,20) U9.5 ; 33.41,15.89 33.41,15.62 C12.2 ; USB1.B4 28.44,5.16 v1(27.83,5.78) 27.32,6.28 27.32,7.66 ; H4.2 H3.2 13.6,35.37 14.24,34.73 18.17,34.73 v1(18.55,34.35) R1.2 19.44,33.84 H2.2 H1.2 ; USB1.A4 USB1.B9 27.32,7.66 27.32,7.66 ; U4.18 25.51,25.49 v1(25.92,25.08) ; 21.84,12.94 22.05,13.14 25.67,13.14 27.57,11.24 LDO1.3 ; LDO1.3 27.32,10.95 27.32,7.66 ; LDO1.3 27.98,11.2 C4.2 C3.2 29.16,15.94 v1(28.97,15.94) ; U6.16 34.56,32.11 34.56,35.62 32.78,37.4 29,37.4 27.86,38.54 SPI.2
  Bottom Layer w0.381: v1(27.83,5.78) 27.83,4.63 28.59,3.87 30.72,3.87 30.73,3.86 31.27,3.86 31.28,3.87 32.66,3.87 v1(33.64,2.89) ; v1(10.81,16.95) 7.76,20 v1(5.81,20) ; v1(19.19,25.33) 19.44,25.08 v1(25.92,25.08) 25.92,23.3 24.81,22.19 24.13,22.19 23.71,21.78 v1(22.87,21.78) ; v1(17.28,27.24) 17.79,27.75 17.79,28.86 17.81,28.88 17.81,29.41 17.79,29.42 17.79,31.05 18.55,31.8 v1(18.55,34.35) ; v1(28.97,15.94) v1(32.27,15.94) ; H1.2 22.46,38.54 23.65,37.35 24.64,37.35 25.83,38.54 SPI.2
GND: length 248.5
  Top Layer w0.381: v1(29.86,28.38) 29.21,27.73 26.77,27.73 26.21,27.17 v1(26.21,27.07) 25.87,27.07 25.07,27.87 24.47,27.87 U4.21 ; U8.1 6.58,32.83 RST.1 12.71,34.35 v1(12.71,34.35) ; 12.86,28.7 11.95,28.7 11.38,28.13 v1(11.06,28.13) ; 12.86,28.7 12.97,28.59 v1(12.97,26.43) 12.97,25.84 X1.2 13.64,25.63 15.13,27.11 15.69,27.11 U4.5 ; 12.86,28.7 15.7,28.7 U4.3 ; C7.1 v1(14.87,15.11) ; C7.1 C8.1 ; C7.1 C6.1 ; C4.1 31.45,10.16 30.45,9.16 30.26,9.16 ; C4.1 31.45,14.47 ; C4.1 31.77,12.95 C12.1 34.68,13.02 35.48,13.81 35.48,14.89 34.68,15.69 C11.1 ; 31.29,3.66 31.13,3.5 v1(31.13,1.2) 31.21,1.12 34.98,1.12 35.83,1.97 R5.1 ; 31.29,3.66 USB1.A12 ; 31.29,3.66 USB1.B1 29.19,3.5 29.14,3.5 28.59,2.95 28.59,2.9 28.21,2.52 28.21,1.08 27.94,0.81 22.49,0.81 C10.2 C9.2 12.33,3.98 12.33,6.06 ; v1(16.52,9.33) 16.52,10.16 U5.1 14.44,11.19 12.33,9.08 12.33,6.06 ; H3.3 H4.3 ; 30.26,9.16 USB1.A1 33.85,9.16 R4.2 R6.2 34.69,6.92 v1(37.1,6.92) 39.06,6.92 U9.1 ; 30.26,9.16 USB1.B12 ; C3.1 31.45,14.47 ; 31.45,14.47 v1(31.64,14.28) ; v1(10.94,26.73) 10.94,24.07 X1.4 12.59,22.42 v1(12.59,21.52) ; 32.02,33.46 v1(29.48,30.92) U6.1 ; 12.33,6.06 9.82,8.57 v1(5.18,8.57) ; v1(29.73,22.79) 30.05,22.48 C5.2 ; H2.3 H1.3
  Bottom Layer w0.381: 38.24,31.43 36.34,33.33 36.34,36.26 34.05,38.54 SPI.6 ; 38.24,31.43 34.05,31.43 32.02,33.46 ; 38.24,31.43 v1(38.8,31.43) 39.31,31.43 ; v1(26.21,27.07) 26.21,26.32 v1(29.73,22.79) 28.65,21.71 24.33,21.71 v1(23.13,20.51) 22.77,20.51 18.3,24.98 18.3,30.16 H2.3 ; v1(25.29,18.09) 29.1,14.28 v1(31.64,14.28) ; v1(29.48,30.92) 30.11,30.92 31.19,29.84 31.19,29.08 30.49,28.38 v1(29.86,28.38) ; v1(12.71,34.35) 14.49,34.35 H3.3 ; 电源.1 21.84,8.55 20.33,7.05 18.81,7.05 v1(16.52,9.33) ; v1(10.94,32.32) 11.06,32.19 v1(11.06,28.13) ; v1(31.13,1.2) 31.51,0.82 33.54,0.82 34.95,2.24 34.95,4.78 v1(37.1,6.92) ; v1(12.97,26.43) 11.2,26.43 10.94,26.7 v1(10.94,26.73) ; v1(5.18,8.57) 6.63,10.02 9.76,10.02 15.29,15.55 15.29,21.51 14.89,21.92 14.35,21.92 13.33,20.9 13.21,20.9 v1(12.59,21.52)
  vias: v1(5.31,31.43) v1(40.4,8.57)
V1: length 17.5
  Bottom Layer w0.254: 30.38,20.61 30.28,20.51 24.4,20.51 19.34,15.45 电源.2
V2: length 23.6
  Top Layer w0.254: 26.68,2.58 v1(26.68,4.51)
  Bottom Layer w0.254: v1(26.68,4.51) 26.68,15.68 24.65,17.71 24.65,18.73 25.41,19.49 29.01,19.49 30.38,18.11
A0: length 17.2
  Top Layer w0.254: U4.23 26.08,29.49 26.87,30.29 34.81,30.29 36.21,28.89 v1(36.68,28.89) U9.8
A1: length 18.5
  Top Layer w0.254: U4.24 24.45,30.29 v1(26.05,30.29) ; U9.7 39.31,27.75 v1(34.56,27.75)
  Bottom Layer w0.254: v1(26.05,30.29) 26.37,29.97 v1(26.37,28.95) 28.02,28.95 29.22,27.75 v1(34.56,27.75)
  vias: v1(36.84,26.35)
A2: length 28.6
  Top Layer w0.254: v1(35.45,25.21) 39.31,25.21 U9.6 ; U4.25 23.07,31.68 v1(23.51,31.68)
  Bottom Layer w0.254: U9.6 39.31,25.21 v1(35.45,25.21) 35.45,27.75 31.43,31.76 23.58,31.76 v1(23.51,31.68)
A3: length 30.1
  Top Layer w0.254: U4.26 22.08,30.95 v1(22.37,30.67)
  Bottom Layer w0.254: v1(22.37,30.67) 21.41,30.67 20.71,29.97 20.71,29.02 21.93,27.8 23.69,27.8 24.26,28.37 27.71,28.37 28.84,27.24 32.14,27.24 34.12,25.26 34.12,18.86 36.79,16.19 v1(37.1,16.19)
A4: length 38.3
  Top Layer w0.254: U4.27 21.35,31.8 21.35,30.8 21.71,30.43 21.73,30.43 21.98,30.18 21.98,30.16 22.24,29.91 v1(22.24,28.38) v1(22.24,27.16) ; I2C.2 27.5,31.48 26.8,31.48 26.37,31.05 v1(26.29,31.05)
  Bottom Layer w0.254: v1(26.29,31.05) 26.12,30.88 25.87,30.88 25.87,30.87 25.56,30.87 23.06,28.38 v1(22.24,28.38) ; v1(22.24,27.16) 23.56,27.16 24.41,28.01 27.37,28.01 33.41,21.97 33.41,17.33 v1(37.1,13.65)
A5: length 40.5
  Top Layer w0.254: I2C.1 26.94,33.08 v1(25.03,31.18) ; v1(21.35,27.37) 21.61,27.63 v1(21.61,29.59) 21.61,29.77 20.48,30.9 U4.28
  Bottom Layer w0.254: v1(21.35,27.37) 21.35,26.86 21.73,26.48 23.63,26.48 24.82,27.66 27.03,27.66 33.06,21.63 33.06,17.19 34.38,15.87 34.38,12.69 34.56,12.51 35.7,12.51 v1(37.1,11.11) ; v1(25.03,31.18) 23.45,29.59 v1(21.61,29.59)
AREF: length 13.1
  Top Layer w0.254: C5.1 31.45,21.34 31,21.79 31,25.52 30.12,26.4 25.87,26.4 25.16,27.11 24.47,27.11 U4.20
D2: length 9.1
  Top Layer w0.254: v1(16.27,31.68) 16.46,31.87 U4.32
  Bottom Layer w0.254: H1.1 17.54,37.02 17.54,35.37 16.27,34.1 v1(16.27,31.68)
D3: length 10.2
  Top Layer w0.254: v1(17.16,29.14) 17.16,29.91 16.78,30.29 15.72,30.29 U4.1
  Bottom Layer w0.254: v1(17.16,29.14) 16.9,29.4 16.9,33.84 H2.1
D4: length 9.1
  Top Layer w0.254: v1(14.35,29.64) 14.49,29.49 U4.2
  Bottom Layer w0.254: H3.1 11.06,34.1 14.35,30.81 v1(14.35,29.64)
D5: length 20.6
  Top Layer w0.254: U4.9 16.71,22.54 v1(16.27,22.54)
  Bottom Layer w0.254: H4.1 9.66,37.14 9.66,34.48 13.55,30.59 13.55,25.26 v1(16.27,22.54)
D6: length 21.3
  Top Layer w0.254: U4.10 18.08,22.44 17.4,21.76 14.8,21.76 14.62,21.59 v1(14.62,21.27)
  Bottom Layer w0.254: v1(14.62,21.27) 14.87,21.02 14.87,20.19 11.93,17.24 11.93,14.01 10.54,12.62 8.51,12.62 7,11.11 U8.8
  vias: v1(9.16,11.14)
D7: length 20.3
  Top Layer w0.254: U4.11 18.88,22.08 18.2,21.41 15.9,21.41 14.75,20.25 v1(14.11,20.25)
  Bottom Layer w0.254: U8.7 5.51,13.98 11.39,13.98 11.57,14.16 11.57,17.71 v1(14.11,20.25)
  vias: v1(9.16,13.65)
D8: length 18.3
  Top Layer w0.254: U4.12 19.68,21.5 19.23,21.05 16.05,21.05 14.49,19.49 12.05,19.49 8.75,16.19 U8.6
  vias: v1(9.16,16.32)
D9: length 19.7
  Top Layer w0.254: U4.13 20.48,21.54 v1(20.46,21.52)
  Bottom Layer w0.254: 5.85,24.06 5.43,24.06 U8.4 5.6,23.81 ; 5.85,24.06 5.6,23.81 ; 5.85,24.06 6.36,24.06 ; 6.36,24.06 6.11,23.81 5.6,23.81 ; 6.36,24.06 v1(8.16,24.06) 13.35,24.06 15.89,21.52 v1(20.46,21.52)
D10: length 22.7
  Top Layer w0.254: U4.14 21.28,23.63 20.69,24.22 16.74,24.22 14.03,21.51 14.03,21.45 13.47,20.89 11.82,20.89 10.43,22.29 10.43,25.97 10.25,26.15 5.38,26.15 U8.3
  vias: v1(9.97,26.15)
D11: length 40.7
  Top Layer w0.254: U4.15 22.08,23.84 v1(19.7,26.22) 18.81,27.11 18.81,29.03 17.04,30.8 14.9,30.8 14.9,30.8 13.35,30.8 11.93,29.38 11.39,29.38 10.9,28.89 v1(10,28.89) U8.2
  Bottom Layer w0.254: v1(19.7,26.22) 18.94,26.98 18.94,29.2 25.41,35.67 25.41,36.47 26.4,37.46 28.65,37.46 29.48,38.29 SPI.4
D12: length 17.5
  Top Layer w0.254: v1(19.82,27.37) 19.82,26.92 22.88,23.87 U4.16
  Bottom Layer w0.254: SPI.1 26.24,36 19.82,29.58 v1(19.82,27.37)
D13: length 16.6
  Top Layer w0.254: U4.17 24.31,24.83 23.51,24.83 22.82,25.51 22.82,30.17 25.41,32.76 25.41,34.22 25.85,34.66 28.13,34.66 SPI.3
D+: length 27.9
  Top Layer w0.254: USB1.A6 32.65,6.67 31.51,6.67 31,6.16 USB1.B6 29.28,6.23 28.59,6.23 v1(28.08,6.74) ; v1(30.75,11.49) 30.75,21.54 30.65,21.64 30.65,25.18 29.99,25.84 U6.5
  Bottom Layer w0.254: v1(30.75,11.49) 30.75,9.4 v1(28.08,6.74)
D-: length 27.1
  Top Layer w0.254: v1(31.13,5.39) 31.89,6.16 USB1.A7 ; U6.6 28.13,24.06 v1(29.73,24.06) ; v1(30.62,6.92) 30.36,6.66 USB1.B7
  Bottom Layer w0.254: v1(31.13,5.39) 30.62,5.9 v1(30.62,6.92) 33.35,9.65 33.35,16 32.41,16.94 32.41,21.48 29.83,24.06 v1(29.73,24.06)
RST: length 21.7
  Top Layer w0.254: 19.68,33.06 20.46,33.84 C13.2 22.14,34.57 23.33,34.57 24.81,33.09 v1(24.81,33.05) ; 19.68,33.06 18.33,33.06 R1.1 16.53,32.83 RST.2 ; 19.68,33.06 U4.29
  Bottom Layer w0.254: SPI.5 30.62,34.61 25.54,34.61 24.81,33.88 v1(24.81,33.05)
RXD/D0: length 20.5
  Top Layer w0.254: U4.30 18.88,31.36 20.76,29.48 20.76,27.06 25.24,22.59 28.44,22.59 28.77,22.26 28.77,18.8 29.35,18.22 R2.1
TXD/D1: length 21.8
  Top Layer w0.254: U4.31 18.08,30.26 20.41,27.93 20.41,26.89 23.38,23.92 23.38,23.31 25.28,21.41 28.16,21.41 28.32,21.25 28.32,18.37 R3.1
$1N1524: length 7.1
  Top Layer w0.254: U4.7 15.16,25.49 14.49,24.82 14.49,24.35 14.33,24.18 12.95,24.18 12.04,25.09 X1.3 12.04,27.21 C1.2
$1N1530: length 9.8
  Top Layer w0.254: v1(17.54,25.72) 16.52,24.69 U4.8 13.98,22.96 X1.1 ; v1(14.43,27.84) 14.4,27.84 C2.2
  Bottom Layer w0.254: v1(17.54,25.72) 15.41,27.84 v1(14.43,27.84)
$1N2494: length 11
  Top Layer w0.254: C10.1 21.73,8.71 21.73,10.6 22.33,11.2 LDO1.1 23.09,11.11 25.54,11.11 25.92,10.73 D1.1
$1N3868: length 15.3
  Top Layer w0.254: U6.2 29.41,29.65 31.36,27.71 31.36,21.94 32.64,20.65 32.64,18.84 32.02,18.22 R2.2
$1N3894: length 17.9
  Top Layer w0.254: U6.3 28.26,29.02 v1(28.97,29.02) ; R3.2 33,18.19 33,20.8 31.71,22.08 31.71,28.31 v1(30.43,29.59)
  Bottom Layer w0.254: v1(28.97,29.02) 29.86,29.02 v1(30.43,29.59)
$1N4022: length 14.2
  Top Layer w0.254: v1(34.06,18.09) 34.68,17.47 C11.2 ; U6.4 27.82,26.91 30.44,26.91 v1(30.77,26.58)
  Bottom Layer w0.254: v1(34.06,18.09) 33.77,18.39 33.77,23.58 v1(30.77,26.58)
$1N11196: length 1.7
  Top Layer w0.254: LED1.1 34.56,3.59 R6.1
$1N13420: length 10.9
  Top Layer w0.254: v1(35.57,9.97) 34.57,9.97 R4.1 ; v1(31,4.51) 30.51,4.51 30.28,4.73 30.28,5.43 30.12,5.59 29.42,5.59 USB1.B5
  Bottom Layer w0.254: v1(35.57,9.97) 35.57,9.08 31.71,5.22 31.71,5.15 31.37,4.81 31.31,4.81 v1(31,4.51)
$1N13426: length 6.2
  Top Layer w0.254: R5.2 36.21,4.86 35.1,5.96 34.01,5.96 33.58,6.39 33.58,6.93 33.33,7.17 32.66,7.17 USB1.A5
$1N15243: length 17.6
  Top Layer w0.254: 22.81,33.84 22.81,33.72 v1(23.83,32.7) ; v1(31.13,31) 32.19,32.06 v1(32.4,32.06) ; v1(31.84,29.7) 32.09,29.45 32.09,27.29 32.27,27.11 U6.13
  Bottom Layer w0.254: v1(32.4,32.06) 32.35,32.12 24.27,32.12 23.83,32.55 v1(23.83,32.7) ; v1(31.13,31) 31.84,30.29 v1(31.84,29.7)

## Copper pours and planes (outline as drawn; the poured copper is in the pictures)
GND on Top Layer: -4.69,40.95 50.56,40.95 50.56,-0.7 -4.69,-0.7
GND on Bottom Layer: -5.07,41.72 51.7,41.72 51.7,-1.46 -5.07,-1.46

## Text on the board
Bottom Silkscreen Layer: 5V | A3 | A4 | g | A5 | A0 | A1 | A2 | D11 | D10 | D8 | D6 | D7 | D9 | MISO | MOSI | SCK | GND | RST | 5 | 4 | v | 2 | 3 | + | - | SCL | SDA
Top Silkscreen Layer: g | 5V
